# Altium project SensorNode Shield.PrjPcb
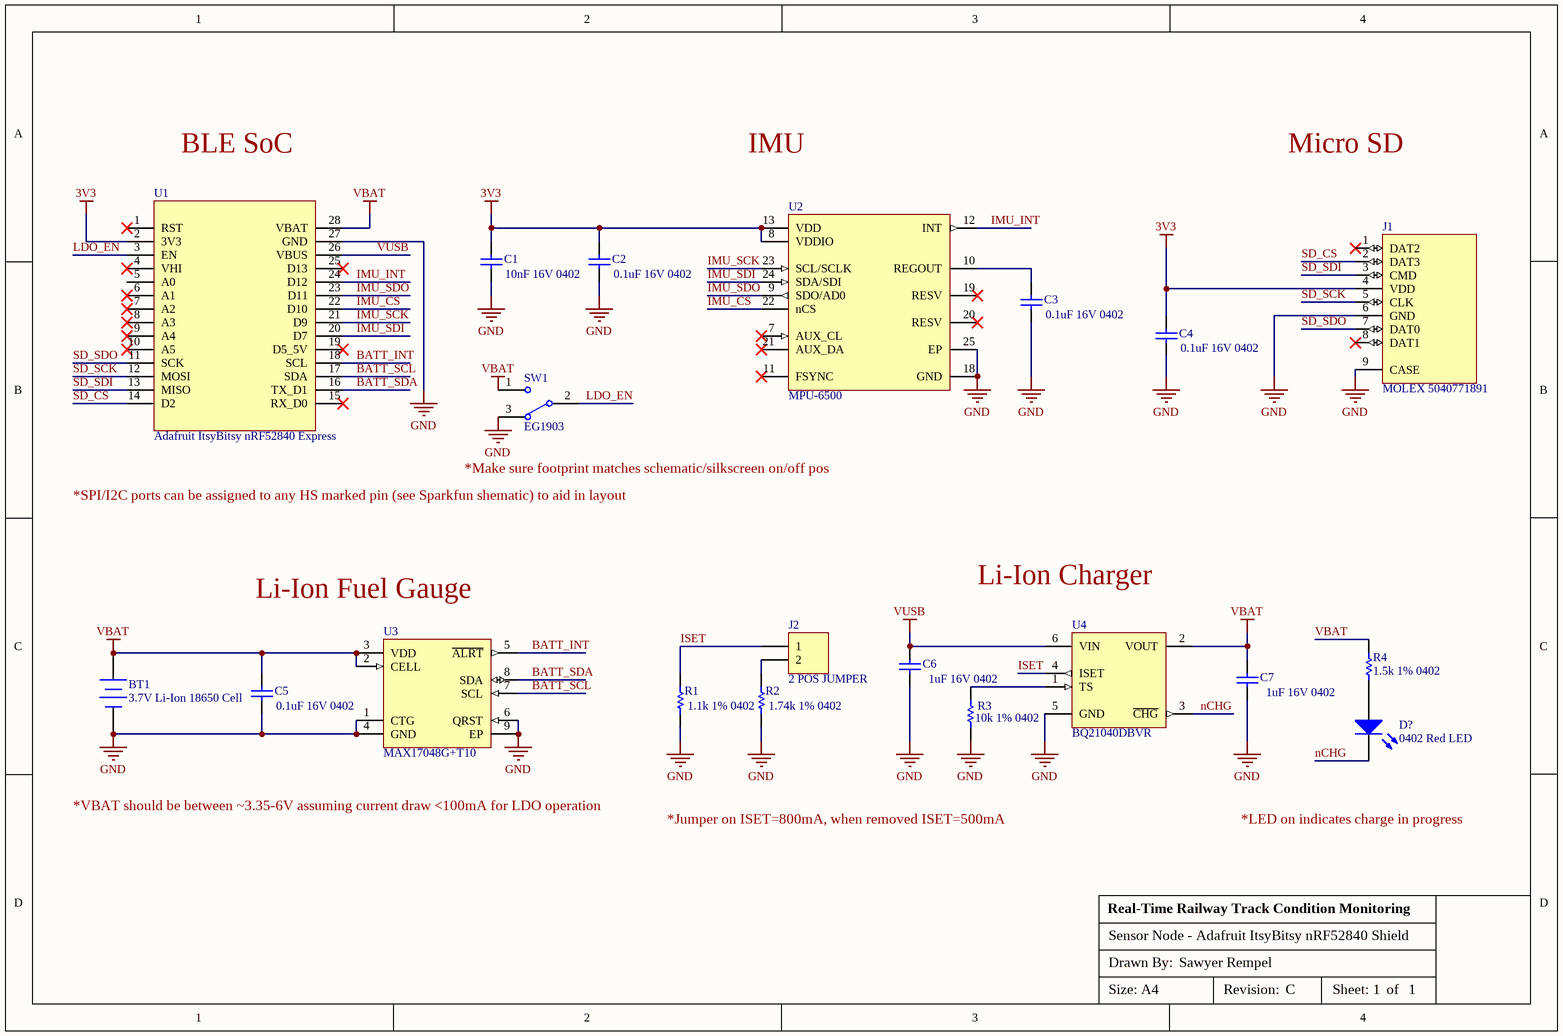
[diagram p0: Sensor Node - Adafruit ItsyBitsy nRF52840 Shield.SchDoc]
1 sheet, 20 parts. Net scope: global (net labels, ports and power ports of the same name join across sheets).
Board file: Sensor Node - Adafruit ItsyBitsy nRF52840 Shield.PcbDoc

## Sheet Sensor Node - Adafruit ItsyBitsy nRF52840 Shield.SchDoc: Sensor Node - Adafruit ItsyBitsy nRF52840 Shield
size A4; DrawnBy: Sawyer Rempel; Revision: C; SheetNumber: 1; SheetTotal: 1

### Parts
BT1  3.7V Li-Ion 18650 Cell  [18650 Battery Clip]
C1  10nF 16V 0402  [0402 CAP]
C2  0.1uF 16V 0402  [0402 CAP]
C3  0.1uF 16V 0402  [0402 CAP]
C4  0.1uF 16V 0402  [0402 CAP]
C5  0.1uF 16V 0402  [0402 CAP]
C6  1uF 16V 0402  [0402 CAP]
C7  1uF 16V 0402  [0402 CAP]
D?  0402 Red LED  [0402 LED]
J1  MOLEX 5040771891  [MOLEX 5040771891]
J2  2 POS JUMPER  [SNT-100-BK-G]
R1  1.1k 1% 0402  [0402 RES]
R2  1.74k 1% 0402  [0402 RES]
R3  10k 1% 0402  [0402 RES]
R4  1.5k 1% 0402  [0402 RES]
SW1  EG1903  [EG1218]
U1  Adafruit ItsyBitsy nRF52840 Express  [Adafruit ItsyBitsy nRF52840 Express]
U2  MPU-6500  [MPU-6500]
U3  MAX17048G+T10  [MAX17048G+T10]
U4  BQ21040DBVR  [BQ21040DBVR]

### Nets
3V3: C1.2 C2.1 C4.1 J1.4(VDD) U1.2(3V3) U2.8(VDDIO) U2.13(VDD)
GND: BT1.2(-) C1.1 C2.2 C3.2 C4.2 C5.2 C6.2 C7.2 J1.6(GND) J1.9(CASE) R1.2 R2.2 R3.2 SW1.3 U1.27(GND) U2.18(GND) U2.25(EP) U3.1(CTG) U3.4(GND) U3.6(QRST) U3.9(EP) U4.5(GND)
VBAT: BT1.1(+) C5.1 C7.1 R4.2 SW1.1 U1.28(VBAT) U3.2(CELL) U3.3(VDD) U4.2(VOUT)
VUSB: C6.1 U1.26(VBUS) U4.6(VIN)
BATT_INT: U1.18(SCL) U3.5(~{ALRT})
BATT_SCL: U1.17(SDA) U3.7(SCL)
BATT_SDA: U1.16(TX_D1) U3.8(SDA)
IMU_CS: U1.22(D10) U2.22(nCS)
IMU_INT: U1.24(D12) U2.12(INT)
IMU_SCK: U1.21(D9) U2.23(SCL/SCLK)
IMU_SDI: U1.20(D7) U2.24(SDA/SDI)
IMU_SDO: U1.23(D11) U2.9(SDO/AD0)
ISET: J2.1 R1.1 U4.4(ISET)
LDO_EN: SW1.2 U1.3(EN)
nCHG: D?.2(K) U4.3(~{CHG})
SD_CS: J1.2(DAT3) U1.14(D2)
SD_SCK: J1.5(CLK) U1.12(MOSI)
SD_SDI: J1.3(CMD) U1.13(MISO)
SD_SDO: J1.7(DAT0) U1.11(SCK)
NetC3_1: C3.1 U2.10(REGOUT)
NetD?_1: D?.1(A) R4.1
NetJ2_2: J2.2 R2.1
NetR3_1: R3.1 U4.1(TS)

Not connected (* = marked no-connect by the designer): J1 1(DAT2)* 8(DAT1)*; U1 1(RST)* 4(VHI)* 5(A0) 6(A1)* 7(A2)* 8(A3)* 9(A4)* 10(A5)* 15(RX_D0)* 19(D5_5V)* 25(D13)*; U2 1(NC) 2(NC) 3(NC) 4(NC) 5(NC) 6(NC) 7(AUX_CL)* 11(FSYNC)* 14(NC) 15(NC) 16(NC) 17(NC) 19(RESV)* 20(RESV)* 21(AUX_DA)* ?1(NC)

### Notes on the sheet
- BLE SoC
- IMU
- Micro SD
- *SPI/I2C ports can be assigned to any HS marked pin (see Sparkfun shematic) to aid in layout
- (near SW1) *Make sure footprint matches schematic/silkscreen on/off pos
- (near U3) Li-Ion Fuel Gauge
- Li-Ion Charger
- *VBAT should be between ~3.35-6V assuming current draw <100mA for LDO operation
- *Jumper on ISET=800mA, when removed ISET=500mA
- *LED on indicates charge in progress
- Real-Time Railway Track Condition Monitoring
- Drawn By:
- Size: A4
- Revision:
- Sheet:     of

### Library data of the parts
BT1 = Battery: Multicell Battery; Digikey PN: 36-54-ND
C1-C7 = Cap: Capacitor
  C1: Value: 10nF; Supplier Part Number: 490-6309-2-ND
  C2-C5: Value: 0.1uF; Supplier Part Number: 490-5415-2-ND
  C6 C7: Value: 1uF; Supplier Part Number: 490-10017-1-ND
D? = LED0: Digikey PN: 754-1104-1-ND
J2 = Header 2H: Digikey PN: SAM8858-ND
R1-R4 = Res1: Resistor
  R1: Digikey PN: 311-1.10KLRCT-ND
  R2: Digikey PN: YAG3046CT-ND
  R3: Digikey PN: 311-10.0KLRCT-ND
  R4: Digikey PN: 311-1.50KLRCT-ND
SW1 = SW-SPDT: SPDT Subminiature Toggle Switch, Right Angle Mounting, Vertical Actuation; Digikey PN: EG1903-ND
U1 = Adafruit ItsyBitsy nRF52840 Express: Digikey PN: S7012-ND
U3 = MAX17048G+T10: Digikey PN: MAX17048G+T10CT-ND
U4 = BQ21040DBVR: Digikey PN: 296-47315-1-ND